# EAGLE design gems-0-01 (EAGLE 8.0.0)
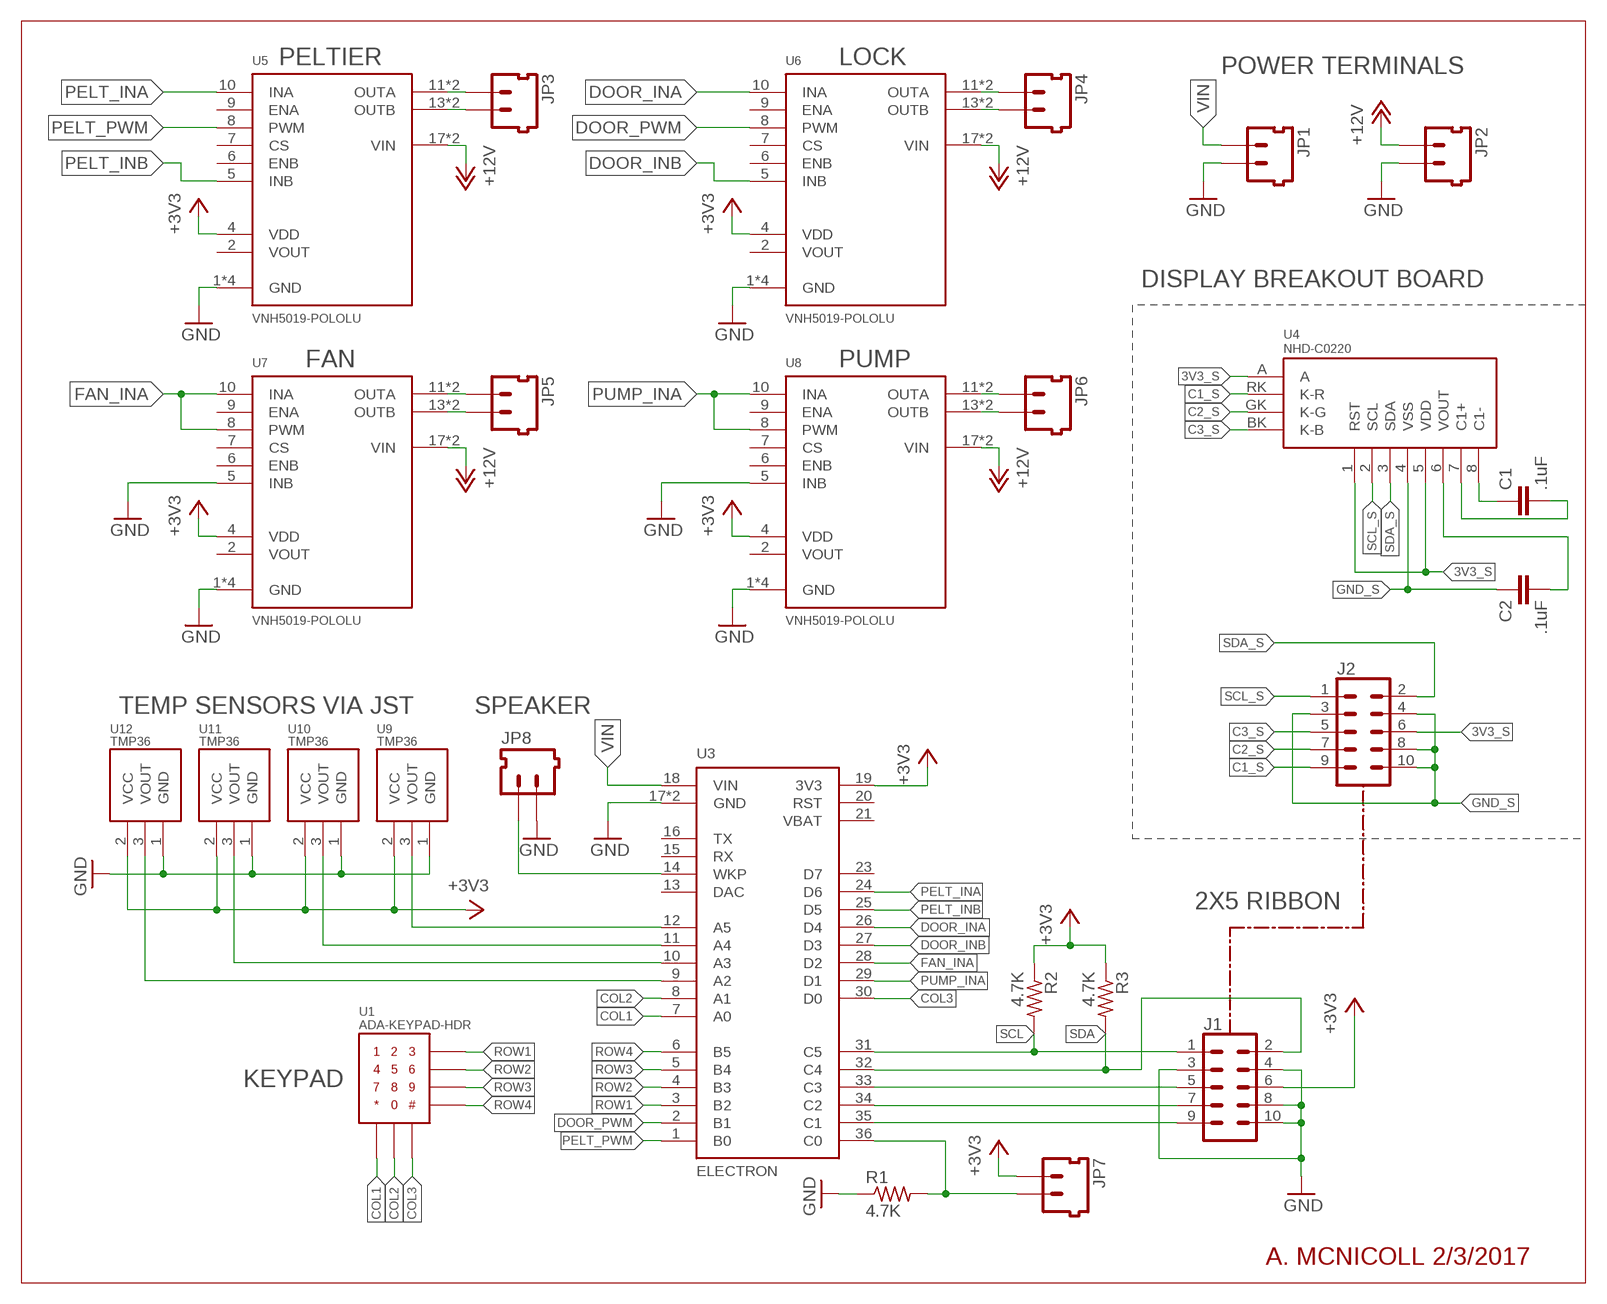
[diagram p0: schematic, sheet 1]

## Parts
C1  .1uF  C-EU025-025X050  [C025-025X050]
C2  .1uF  C-EU025-025X050  [C025-025X050]
J1  CONN_05X2SHD-NS  [2X5-SHROUDED-NS]
J2  CONN_05X2SHD-NS  [2X5-SHROUDED-NS]
JP1  SCREW-TERMINAL-2PIN-5MM-KEYED  [SCREWTERMINAL-5MM-2-DIAG]
JP2  SCREW-TERMINAL-2PIN-5MM-KEYED  [SCREWTERMINAL-5MM-2-DIAG]
JP3  SCREW-TERMINAL-2PIN-5MM-KEYED  [SCREWTERMINAL-5MM-2-DIAG]
JP4  SCREW-TERMINAL-2PIN-5MM-KEYED  [SCREWTERMINAL-5MM-2-DIAG]
JP5  SCREW-TERMINAL-2PIN-5MM-KEYED  [SCREWTERMINAL-5MM-2-DIAG]
JP6  SCREW-TERMINAL-2PIN-5MM-KEYED  [SCREWTERMINAL-5MM-2-DIAG]
JP7  SCREW-TERMINAL-2PIN-5MM-KEYED  [SCREWTERMINAL-5MM-2-DIAG]
JP8  SCREW-TERMINAL-2PIN-5MM-KEYED  [SCREWTERMINAL-5MM-2-DIAG]
R1  4.7K  R-US_0204/5  [0204/5]
R2  4.7K  R-US_0204/5  [0204/5]
R3  4.7K  R-US_0204/5  [0204/5]
U1  ADA-KEYPAD-HDR  [HDR-7-STAGGERED]
U3  ELECTRON  [ELECTRON]
U4  NHD‐C0220  [NHD-C0220]
U5  VNH5019-POLOLU  [VNH1519-CARRIER]
U6  VNH5019-POLOLU  [VNH1519-CARRIER]
U7  VNH5019-POLOLU  [VNH1519-CARRIER]
U8  VNH5019-POLOLU  [VNH1519-CARRIER]
U9  TMP36  [JST-3-PTH]
U10  TMP36  [JST-3-PTH]
U11  TMP36  [JST-3-PTH]
U12  TMP36  [JST-3-PTH]

## Nets
3V3_S: J2.6 U4.1(RST) U4.5(VDD) U4.A
+3V3: J1.6 JP7.F R2.1 R3.1 U3.19(3V3) U5.4(VDD) U6.4(VDD) U7.4(VDD) U8.4(VDD) U9.2(VCC) U10.2(VCC) U11.2(VCC) U12.2(VCC)
+12V: JP2.F U5.17(VIN) U5.18(VIN) U6.17(VIN) U6.18(VIN) U7.17(VIN) U7.18(VIN) U8.17(VIN) U8.18(VIN)
C1_S: J2.9 U4.RK(K-R)
C2_S: J2.7 U4.GK(K-G)
C3_S: J2.5 U4.BK(K-B)
COL1: U1.5(C1) U3.7(A0)
COL2: U1.6(C2) U3.8(A1)
COL3: U1.7(C3) U3.30(D0)
DOOR_INA: U3.26(D4) U6.10(INA)
DOOR_INB: U3.27(D3) U6.5(INB)
DOOR_PWM: U3.2(B1) U6.8(PWM)
FAN_INA: U3.28(D2) U7.8(PWM) U7.10(INA)
GND: J1.3 J1.4 J1.8 J1.10 JP1.M JP2.M JP8.M R1.1 U3.17(GND) U3.22(GND) U5.1(GND) U5.3(GND) U5.15(GND) U5.16(GND) U6.1(GND) U6.3(GND) U6.15(GND) U6.16(GND) U7.1(GND) U7.3(GND) U7.5(INB) U7.15(GND) U7.16(GND) U8.1(GND) U8.3(GND) U8.5(INB) U8.15(GND) U8.16(GND) U9.1(GND) U10.1(GND) U11.1(GND) U12.1(GND)
GND_S: C2.1 J2.3 J2.4 J2.8 J2.10 U4.4(VSS)
N$1: JP3.F U5.11(OUTA) U5.12(OUTA)
N$2: JP3.M U5.13(OUTB) U5.14(OUTB)
N$3: U3.12(A5) U9.3(VOUT)
N$4: U3.11(A4) U10.3(VOUT)
N$5: U3.10(A3) U11.3(VOUT)
N$6: JP4.F U6.11(OUTA) U6.12(OUTA)
N$7: JP4.M U6.13(OUTB) U6.14(OUTB)
N$8: JP5.F U7.11(OUTA) U7.12(OUTA)
N$9: JP5.M U7.13(OUTB) U7.14(OUTB)
N$10: JP6.F U8.11(OUTA) U8.12(OUTA)
N$11: JP6.M U8.13(OUTB) U8.14(OUTB)
N$12: U3.9(A2) U12.3(VOUT)
N$13: JP7.M R1.2 U3.36(C0)
N$14: JP8.F U3.14(WKP)
N$15: C1.1 U4.8(C1-)
N$16: C1.2 U4.7(C1+)
N$17: C2.2 U4.6(VOUT)
N$25: J1.9 U3.35(C1)
N$26: J1.7 U3.34(C2)
N$27: J1.5 U3.33(C3)
PELT_INA: U3.24(D6) U5.10(INA)
PELT_INB: U3.25(D5) U5.5(INB)
PELT_PWM: U3.1(B0) U5.8(PWM)
PUMP_INA: U3.29(D1) U8.8(PWM) U8.10(INA)
ROW1: U1.1(R1) U3.3(B2)
ROW2: U1.2(R2) U3.4(B3)
ROW3: U1.3(R3) U3.5(B4)
ROW4: U1.4(R4) U3.6(B5)
SCL: J1.1 R2.2 U3.31(C5)
SCL_S: J2.1 U4.2(SCL)
SDA: J1.2 R3.2 U3.32(C4)
SDA_S: J2.2 U4.3(SDA)
VIN: JP1.F U3.18(VIN)
Unconnected: U3.13(DAC) U3.15(RX) U3.16(TX) U3.20(RST) U3.21(VBAT) U3.23(D7) U5.2(VOUT) U5.6(ENB) U5.7(CS) U5.9(ENA) U6.2(VOUT) U6.6(ENB) U6.7(CS) U6.9(ENA) U7.2(VOUT) U7.6(ENB) U7.7(CS) U7.9(ENA) U8.2(VOUT) U8.6(ENB) U8.7(CS) U8.9(ENA)

## Notes on the sheet
- PELTIER | LOCK
- POWER TERMINALS
- DISPLAY BREAKOUT BOARD
- FAN | PUMP
- TEMP SENSORS VIA JST | SPEAKER
- 2X5 RIBBON
- KEYPAD
- A. MCNICOLL 2/3/2017

## Library data of the parts
C1 C2 = gems:C-EU: CAPACITOR, European symbol; SPICEPREFIX: C
J1 J2 = gems:CONN_05X2: Multi connection point. Often used as Generic Header-pin footprint for 0.1 inch spaced/style header connections For AVR SPI programming port, see special device with nice symbol: "AVR_SPI_PROG_5x2.dev" You can populate with any combo of single row headers, but if you'd like an exact match, check these: 2x5 AVR ICSP Male Header <https://www.sparkfun.com/products/778> (PRT-00778) 2x5 Pin Shrouded Header <https://www.sparkfun.com/products/8506> (PRT-08506) On any of the 0.1 inch spaced packages, you can populate with these: Break Away Headers - Straight <https://www.sparkfun.com/products/116> (PRT-00116) Break Away Male Headers - Right Angle <https://www.sparkfun.com/products/553> (PRT-00553) Female Headers <https://www.sparkfun.com/products/115> (PRT-00115) Break Away Headers - Machine Pin <https://www.sparkfun.com/products/117> (PRT-00117) Break Away Female Headers - Swiss Machine Pin <https://www.sparkfun.com/products/743> (PRT-00743) Special note: the shrouded connector mates well with our 5x2 ribbon cables: 2x5 Pin IDC Ribbon Cable <https://www.sparkfun.com/products/8535> (PRT-08535); PROD_ID: CONN-08671; SF_ID: PRT-08506
JP1-JP8 = gems:SCREW-TERMINAL-2PIN-5MM-KEYED
R1-R3 = gems:R-US_: RESISTOR, American symbol
U1 = gems:ADA-KEYPAD
U3 = gems:ELECTRON
U4 = gems:NHD‐C0220
U5-U8 = gems:VNH5019-POLOLU
U9-U12 = gems:TMP36

## Board
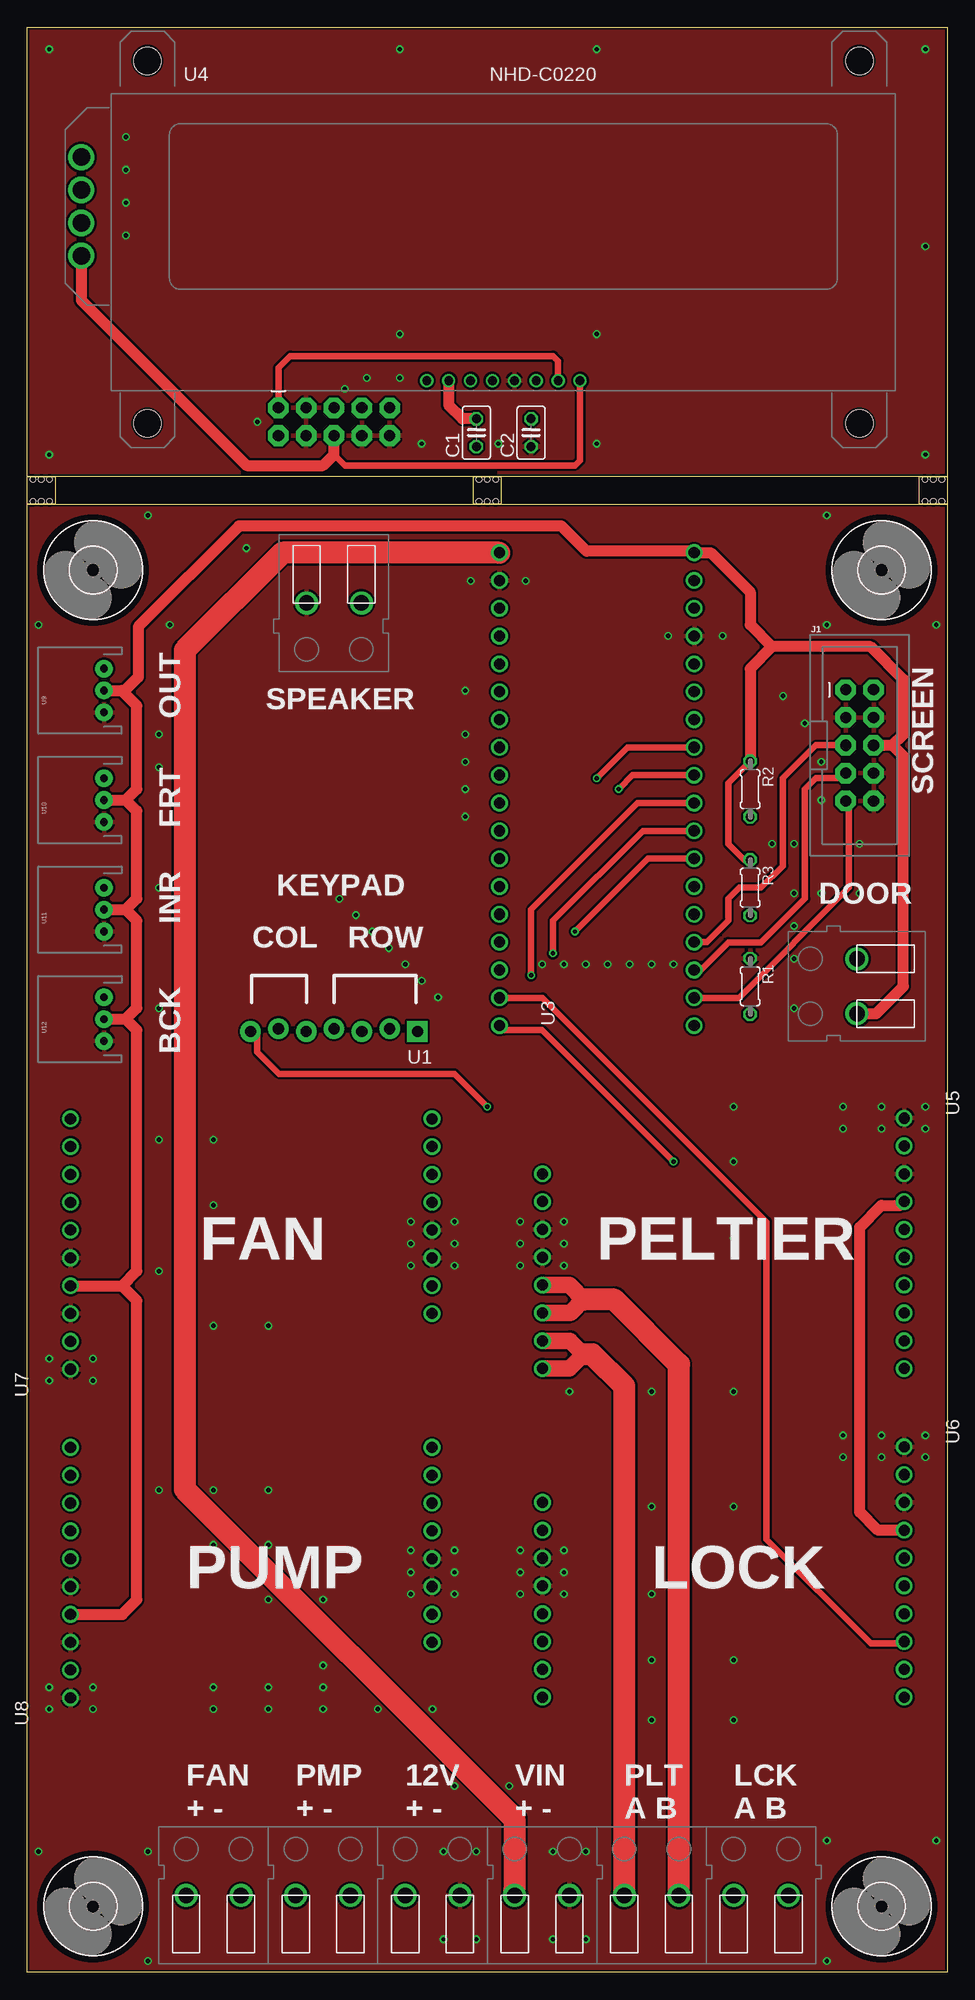
[diagram p1: board, top side]
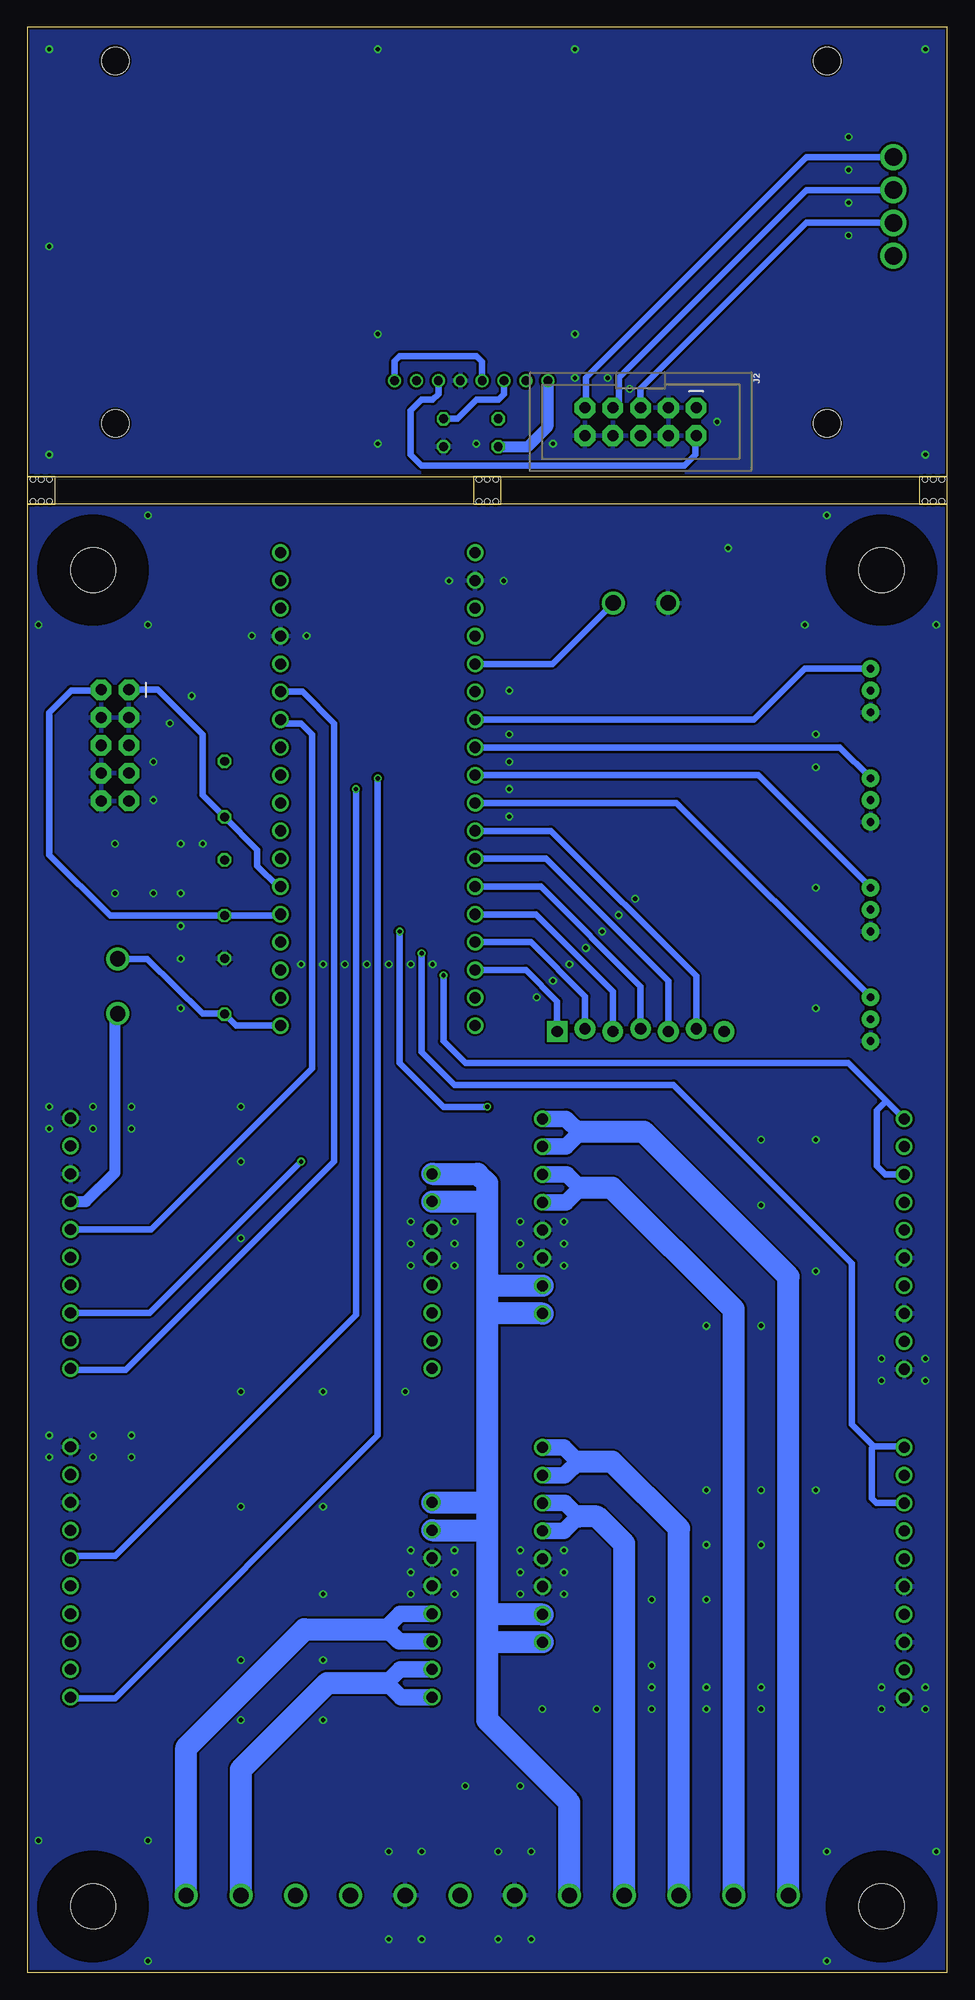
[diagram p2: board, bottom side, seen from below]

Size 84 x 177.54 mm. Coordinates in mm from the lower left corner, seen from the top.
Outline: 0,177.54 84,177.54 84,136.54 0,136.54 0,177.54
Outline: 0,134 84,134 84,0 0,0 0,134
Copper layers (1*16): Top 0.035mm / dielectric 1.5mm / Bottom 0.035mm
Design rules "littleBitsDRC": minimum track width 0.2mm, minimum drill 0.2mm, track to track 0.2mm, track to pad 0.2mm, pad to pad 0.2mm, via to via 0.2mm, smd to smd 0mil, copper to edge 0.2mm, drill to drill 0.2mm, minimum pad ring 0.1mm, minimum via ring 0.15mm, stop-mask expansion 0.1mm, vias tented up to drill 0.5mm, thermal gap 0.2mm

### Footprints (pad centres in the part's own frame; a part is rotated, then mirrored left to right if it is on the bottom)
C025-025X050 = drill 0.813 octagon: 1 -1.27,0; 2 1.27,0
2X5-SHROUDED-NS = drill 1.016 pad 1.88 octagon: 1 -1.27,5.08; 2 1.27,5.08; 3 -1.27,2.54; 4 1.27,2.54; 5 -1.27,0; 6 1.27,0; 7 -1.27,-2.54; 8 1.27,-2.54; 9 -1.27,-5.08; 10 1.27,-5.08
SCREWTERMINAL-5MM-2-DIAG = drill 1.4: F -2.5,0; M 2.5,0
0204/5 = drill 0.813 octagon: 1 -2.54,0; 2 2.54,0
HDR-7-STAGGERED = drill 1.016 pad 1.88 square: 1 -7.62,0.127 | drill 1.016 pad 1.88: 2 -5.08,-0.127; 3 -2.54,0.127; 4 0,-0.127; 5 2.54,0.127; 6 5.08,-0.127; 7 7.62,0.127
ELECTRON = drill 1.016: 1 -8.89,-21.59; 2 -8.89,-19.05; 3 -8.89,-16.51; 4 -8.89,-13.97; 5 -8.89,-11.43; 6 -8.89,-8.89; 7 -8.89,-6.35; 8 -8.89,-3.81; 9 -8.89,-1.27; 10 -8.89,1.27; 11 -8.89,3.81; 12 -8.89,6.35; 13 -8.89,8.89; 14 -8.89,11.43; 15 -8.89,13.97; 16 -8.89,16.51; 17 -8.89,19.05; 18 -8.89,21.59; 19 8.89,21.59; 20 8.89,19.05; 21 8.89,16.51; 22 8.89,13.97; 23 8.89,11.43; 24 8.89,8.89; 25 8.89,6.35; 26 8.89,3.81; 27 8.89,1.27; 28 8.89,-1.27; 29 8.89,-3.81; 30 8.89,-6.35; 31 8.89,-8.89; 32 8.89,-11.43; 33 8.89,-13.97; 34 8.89,-16.51; 35 8.89,-19.05; 36 8.89,-21.59
NHD-C0220 = drill 0.8: 1 7,-15.9; 2 5,-15.9; 3 3,-15.9; 4 1,-15.9; 5 -1,-15.9; 6 -3,-15.9; 7 -5,-15.9; 8 -7,-15.9 | drill 1.6: A -38.55,-4.5; BK -38.55,-1.5; GK -38.55,1.5; RK -38.55,4.5 | hole 2.5: -32.5,-19.8; 32.5,-19.8; -32.5,13.3; 32.5,13.3
VNH1519-CARRIER = drill 1.016: 1 2.54,35.56; 2 5.08,35.56; 3 7.62,35.56; 4 10.16,35.56; 5 12.7,35.56; 6 15.24,35.56; 7 17.78,35.56; 8 20.32,35.56; 9 22.86,35.56; 10 25.4,35.56; 11 25.4,2.54; 12 22.86,2.54; 13 20.32,2.54; 14 17.78,2.54; 15 15.24,2.54; 16 12.7,2.54; 17 10.16,2.54; 18 7.62,2.54
JST-3-PTH = drill 0.7 pad 1.6: 1 -2,0; 2 0,0; 3 2,0
4,1 = hole 4.1: 0,0
SUPPORT_TAB_100MIL = hole 0.508: 0,1.016; -0.762,1.016; 0.762,1.016; 0,-1.016; -0.762,-1.016; 0.762,-1.016

### Placement (x,y rotation side)
C1  41,140.54 90 top
C2  46,140.54 90 top
J1  76,112 0 top
J2  28,141.54 270 bottom
JP1  47,7 0 top
JP2  37,7 0 top
JP3  57,7 0 top
JP4  67,7 0 top
JP5  17,7 0 top
JP6  27,7 0 top
JP7  75.75,90 90 top
JP8  28,125 180 top
R1  66,90 270 top
R2  66,108 270 top
R3  66,99 270 top
U1  28,86 180 top
U3  52,108 0 top
U4  43.47,161.19 0 top
U5  44.5,80.5 270 top
U6  44.5,50.5 270 top
U7  39.5,52.5 90 top
U8  39.5,22.5 90 top
U9  7,117 90 top
U10  7,107 90 top
U11  7,97 90 top
U12  7,87 90 top
U$1  [4,1]  6,128 0 top
U$2  [4,1]  78,128 0 top
U$3  [SUPPORT_TAB_100MIL]  1.27,135.27 0 top
U$4  [SUPPORT_TAB_100MIL]  42,135.27 0 top
U$5  [SUPPORT_TAB_100MIL]  82.73,135.27 0 top
U$6  [4,1]  6,6 0 top
U$7  [4,1]  78,6 0 top

### Tracks (layer width: path | path; a pad name or v marks a point on that pad's centre or on a via)
3V3_S
  Top 0.6: U4.1 50.47,138.01 50,137.54 29,137.54 28,138.54
  Top 1: J2.6 28,138.54 27,137.54 20,137.54 4.92,152.62 U4.A
  Bottom 0.6: U4.5 42.47,147.01 43,147.54 50,147.54 50.47,147.07 U4.1
+3V3
  Top 0.6: R3.1 65.46,101.54 64,103 64,108.54 R2.1 | 79.72,70 U5.4
  Top 1: 68,121 66,123 66,126 62.41,129.59 U3.19 60.72,129.59 60.72,129.72 51.06,129.72 48.76,132.02 19.32,132.02 10.12,122.82 10.12,118.22 8.76,116.86 | 68,121 66,119 R2.1 | J1.6 79,112 | 79,112 80,113 80,118 77,121 68,121 | JP7.F 77.5,87.5 80,90 80,111 79,112 | U10.2 9,107 | 9,107 10,108 10,115.62 8.76,116.86 | U11.2 9,97 | 9,97 10,98 10,106 9,107 | U12.2 9,87 | 9,87 10,88 10,96 9,97 | U7.4 8.66,62.66 | 8.66,62.66 10,64 10,86 9,87 | U8.4 8.66,32.66 10,34 10,61.32 8.66,62.66 | U6.4 77.66,40.34 76,42 76,68 78,70 79.72,70 | U9.2 8.62,117 8.76,116.86
  Bottom 0.6: 76,87.25 JP7.F
  Bottom 1: U5.4 78.66,70.34 76,73 76,87.25
+12V
  Bottom 2: JP2.F 34.5,15.5 42,23 42,30 | 42,30 42,33 | 42,33 42,40 | 42,40 42,43 | 42,43 42,60 | 42,60 42,63 | 42,63 42,70 | 42,70 42,72 42.88,72.88 U5.18 | U5.17 42.34,70.34 42,70 | U7.17 41.66,62.66 42,63 | U7.18 41.88,60.12 42,60 | U6.18 42.12,42.88 42,43 | U6.17 42.34,40.34 42,40 | U8.18 41.88,30.12 42,30 | U8.17 41.66,32.66 42,33
C1_S
  Bottom 0.6: U4.RK 12.85,165.69 33,145.54 33,142.89 J2.9
C2_S
  Bottom 0.6: U4.GK 12.85,162.69 30,145.54 30,143.35 J2.7
C3_S
  Bottom 0.6: U4.BK 12.85,159.69 28,144.54 J2.5
COL1
  Bottom 0.6: U3.7 36.65,101.65 25.46,90.46 U1.5
COL2
  Bottom 0.6: U3.8 36.19,104.19 22.92,90.92 U1.6
COL3  (via drill 0.4)
  Top 0.6: U3.30 56.65,101.65 v50,95 | v42,79 39,82 23,82 21,84 21,85.49 U1.7
  Bottom 0.6: v50,95 50,83 46,79 v42,79
DOOR_INA  (via drill 0.4)
  Top 0.6: U3.26 54.81,111.81 v52,109
  Bottom 0.6: v52,109 52,49 76,25 79.96,25 U6.10
DOOR_INB  (via drill 0.4)
  Top 0.6: U3.27 55.27,109.27 v54,108
  Bottom 0.6: v54,108 54,60 76,38 79.86,38 U6.5
DOOR_PWM
  Top 0.6: U3.2 47.05,88.95 67.5,68.5 67.5,39.5 77,30 79.88,30 U6.8
FAN_INA  (via drill 0.4)
  Top 0.6: U3.28 55.73,106.73 46,97 v46,91
  Bottom 0.6: v46,91 46,85 44,83 9.04,83 5.57,79.53 | 5.57,79.53 U7.10 | U7.8 5.66,72.82 6.44,73.6 6.44,78.66 5.57,79.53
GND  (via drill 0.4)
  other vias: 38,3 41,3 38,11 41,11 48,11 51,11 48,3 51,3 11,1 1,11 11,11 73,1 73,12 83,12 83,123 73,123 73,133 11,133 1,123 13,123 20,130 12,113 12,110 12,99 12,88 12,76 12,64 12,44 40,117 40,113 40,108 40,110.5 40,105.5 28.5,98 30,96.5 31.5,95 33,93.5 34.5,92 36,90.5 37.5,89 47,92 49,92 51,92 53,92 55,92 57,92 59,92 40.5,127 45.5,127 58.5,122 63.5,122 69,116.5 71,114 72.5,110.5 72.5,107 70,103 68,103 70,95.5 70,98.5 70,92.5 70,88 72.5,98.5 76,98.5 76,103 78,79 78,77 82,79 82,77 74.5,77 74.5,79 82,47 82,49 78,49 78,47 74.5,47 74.5,49 45,38.5 49,38.5 49,34.5 45,34.5 49,36.5 45,36.5 45,64.5 49,64.5 49,66.5 49,68.5 45,68.5 45,66.5 39,34.5 35,34.5 35,36.5 35,38.5 39,38.5 39,36.5 39,64.5 35,64.5 39,66.5 35,66.5 35,68.5 39,68.5 2,54 2,56 6,56 6,54 2,24 2,26 6,26 6,24 17,24 17,26 22,26 22,24 27,24 27,26 32,24 37,24 22,34 22,39 17,39 17,44 27,34 27,28 39,17 44,17 17,59 22,59 22,44 17,70 17,76 57,23 57,28.5 64.5,28.5 64.5,23 57,34.5 57,42.5 64.5,42.5 57,53 64.5,53 49.5,53 64.5,67 64.5,74 64.5,79
  pour Bottom: -1,135 85,135 85,-1 -1,-1
  pour Top: -2,135 86,135 86,-2 -2,-2
GND_S  (via drill 0.4)
  other vias: 9,164.54 9,161.54 29,144.54 31,145.54 9,158.54 9,167.54 2,175.54 2,138.54 21,141.54 36,139.54 34,145.54 34,149.54 43,139.54 52,139.54 52,149.54 82,138.54 82,175.54 82,157.54 34,175.54 52,175.54
  pour Bottom (rank 2): -1,178.54 85,178.54 85,135.54 -1,135.54
  pour Top (rank 2): -2,179.54 86,179.54 86,135 -2,135
N$1
  Top 1.5: U5.11 49.5,55.1 50.8,56.4 49.56,57.64 U5.12
  Top 2: JP3.F 54.5,53.5 51.6,56.4 50.8,56.4
N$2
  Top 1.5: U5.13 49.58,60.18 50.8,61.4 49.48,62.72 U5.14
  Top 2: JP3.M 59.5,55.5 53.6,61.4 50.8,61.4
N$3
  Bottom 0.6: U3.12 17.65,114.35 13,119 U9.3
N$4
  Bottom 0.6: U3.11 9.81,111.81 U10.3
N$5
  Bottom 0.6: U3.10 17.27,109.27 U11.3
N$6
  Bottom 1.5: U6.12 49.96,27.64 51.2,26.4 49.9,25.1 U6.11
  Bottom 2: JP4.F 64.5,18.5 56.6,26.4 51.2,26.4
N$7
  Bottom 1.5: U6.14 49.98,32.72 51.3,31.4 51.2,31.3 50.08,30.18 U6.13
  Bottom 2: JP4.M 69.5,20.5 58.7,31.3 51.2,31.3
N$8
  Bottom 1: 33.6,76.6 33.6,76.7
  Bottom 1.5: U7.11 34.8,77.9 33.6,76.7 | U7.12 34.84,75.36 33.6,76.6
  Bottom 2: JP5.F 14.5,63.5 27.7,76.7 33.6,76.7
N$9
  Bottom 1.5: U7.14 34.82,70.28 33.5,71.6 34.72,72.82 U7.13
  Bottom 2: JP5.M 19.5,60.5 30.6,71.6 33.5,71.6
N$10
  Bottom 1.5: U8.11 35,47.9 33.7,46.6 34.94,45.36 U8.12
  Bottom 2: JP6.F 24.5,40.5 30.6,46.6 33.7,46.6
N$11
  Bottom 1.5: U8.13 34.92,42.82 33.7,41.6 35.02,40.28 U8.14
  Bottom 2: JP6.M 29.5,39.1 32,41.6 33.7,41.6
N$12
  Bottom 0.6: U3.9 24.73,106.73 U12.3
N$13
  Bottom 0.6: U3.36 64.95,86.41 R1.2 66,87.5 68,87.5 73.04,92.5 JP7.M
N$14
  Bottom 0.6: U3.14 36.07,119.43 JP8.F
N$15
  Bottom 1: C1.1 38.27,139.27 36.47,141.07 U4.8
N$16
  Top 1: C1.2 39.73,141.81 38.47,143.07 U4.7
N$17
  Bottom 0.6: U4.6 40.47,144.07 41,143.54 43,143.54 44.73,141.81 C2.2
N$25
  Top 0.6: U3.35 64.95,88.95 75,99 75,106.65 J1.9
N$26
  Top 0.6: U3.34 61.49,91.49 64,94 67,94 71,98 71,108 72,109 74.27,109 J1.7
N$27
  Top 0.6: U3.33 62.03,94.03 64,96 64,98 65,99 67,99 69,101 69,109 72,112 J1.5
PELT_INA
  Bottom 0.6: U3.24 58.89,116.89 56,114 56,74 75,55 79.96,55 U5.10
PELT_INB
  Bottom 0.6: U5.5 72.7,67.8 58,82.5 58,113 59,114 60.54,114 U3.25
PELT_PWM  (via drill 0.4)
  Top 0.6: v59,74 47,86 43.52,86 U3.1
  Bottom 0.6: U5.8 72.82,60.18 v59,74
PUMP_INA  (via drill 0.4)
  Top 0.6: U3.29 56.19,104.19 48,96 v48,93
  Bottom 0.6: v48,93 48,84 45,81 25,81 8.7,64.7 8.7,50 6.7,48 | 6.7,48 4.04,48 U8.10 | U8.8 6.48,42.82 6.9,43.24 6.9,47.8 6.7,48
ROW1
  Bottom 0.6: U3.3 38.49,91.49 35.62,88.62 U1.1
ROW2
  Bottom 0.6: U1.2 33.08,89.08 38.03,94.03 U3.4
ROW3
  Bottom 0.6: U3.5 37.57,96.57 30.54,89.54 U1.3
ROW4
  Bottom 0.6: U3.6 37.11,99.11 28,90 U1.4
SCL
  Bottom 0.6: J1.1 72.08,117.08 68,113 68,107.46 R2.2 63,102.46 63,101 61.11,99.11 U3.31
SCL_S
  Top 0.6: J2.1 22.92,146.46 24,147.54 48,147.54 48.47,147.07 U4.2
SDA
  Bottom 0.6: U3.32 61,96.46 R3.2 76.46,96.46 82,102 82,115 80,117 77.35,117 J1.2
SDA_S
  Bottom 0.6: U4.3 46.47,144.07 47,143.54 48,143.54 49,142.54 49,138.54 48,137.54 24,137.54 23,138.54 23,140.19 J2.2
VIN
  Top 0.6: 44.46,7.5 JP1.F
  Top 2: U3.18 23.29,129.59 14.38,120.68 14.38,44.08 44.46,14 44.46,7.5

### Text on the board
tPlace: OUT | SPEAKER | FRT | SCREEN | INR | KEYPAD | DOOR | COL | ROW | BCK | FAN | PELTIER | PUMP | LOCK | FAN / + - | PMP / + - | 12V / + - | VIN / + - | PLT / A B | LCK / A B